# Altium schematic sheet STB_DUTConnector.SchDoc: STB  Sensor Board
size A4; Author: flmoll / gruprecht; DrawnBy: flmoll; Organization: PBL; Revision: A; SheetNumber: 8; SheetTotal: 8
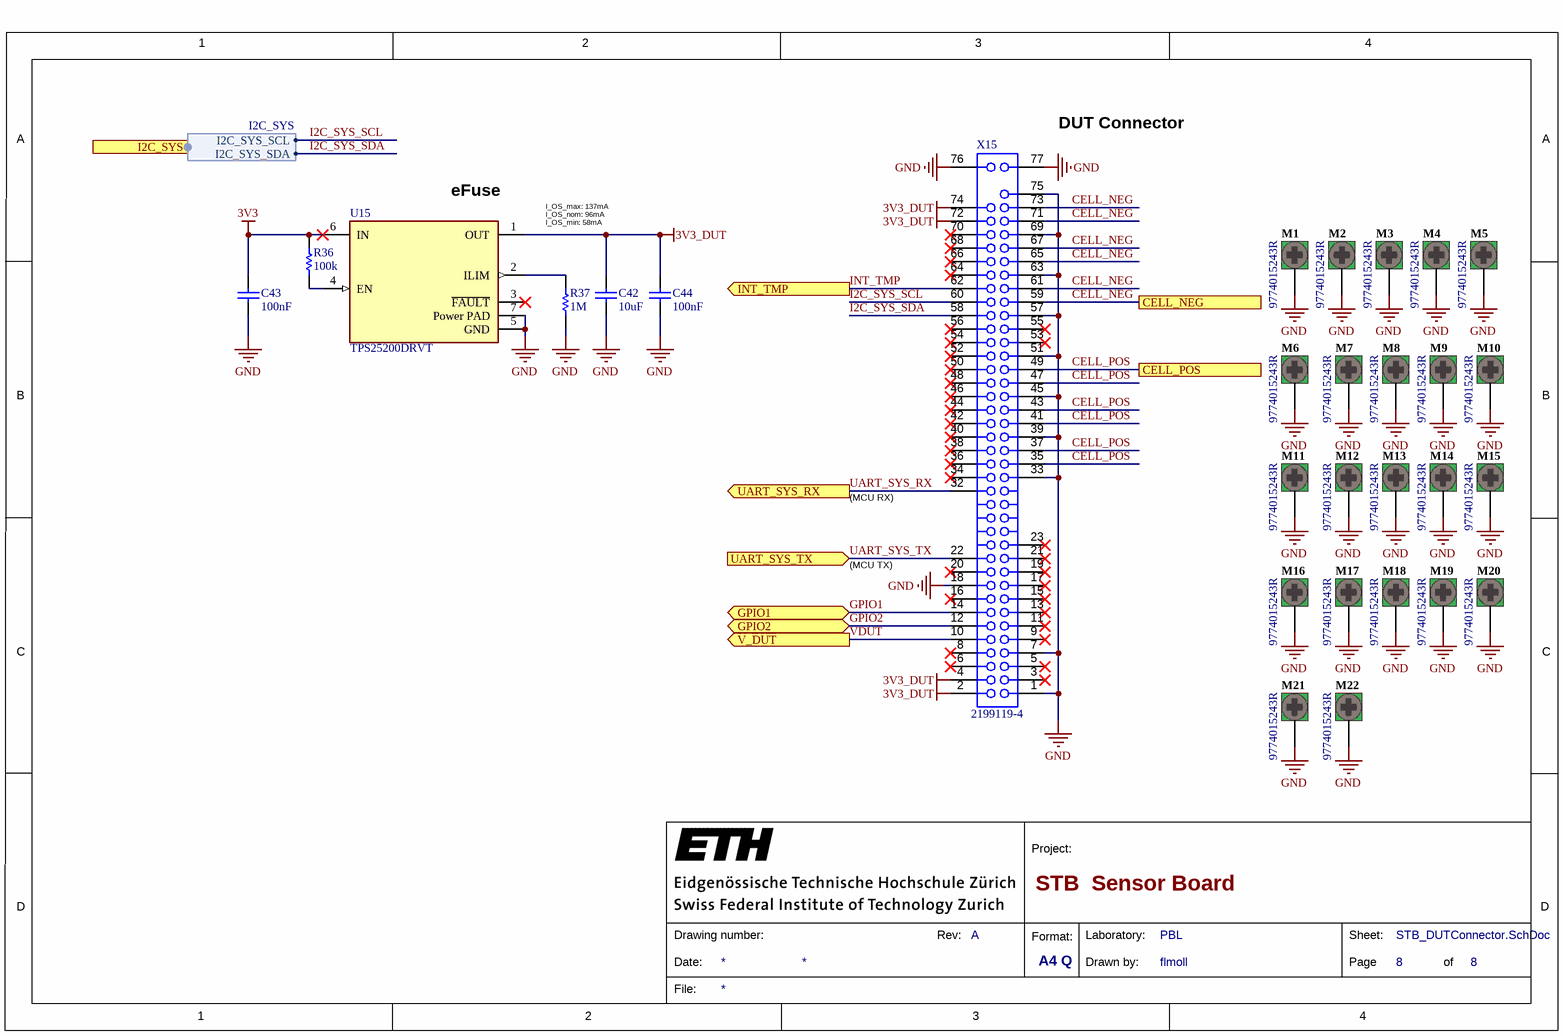
[diagram p0: STB_DUTConnector.SchDoc]

## Parts
C42  10uF  [CAPC0603(1608)100_L]
C43  100nF  [CAPC1050X55X23LL05T13]
C44  100nF  [CAPC1050X55X23LL05T13]
M1  9774015243R  [9774015243R]
M2  9774015243R  [9774015243R]
M3  9774015243R  [9774015243R]
M4  9774015243R  [9774015243R]
M5  9774015243R  [9774015243R]
M6  9774015243R  [9774015243R]
M7  9774015243R  [9774015243R]
M8  9774015243R  [9774015243R]
M9  9774015243R  [9774015243R]
M10  9774015243R  [9774015243R]
M11  9774015243R  [9774015243R]
M12  9774015243R  [9774015243R]
M13  9774015243R  [9774015243R]
M14  9774015243R  [9774015243R]
M15  9774015243R  [9774015243R]
M16  9774015243R  [9774015243R]
M17  9774015243R  [9774015243R]
M18  9774015243R  [9774015243R]
M19  9774015243R  [9774015243R]
M20  9774015243R  [9774015243R]
M21  9774015243R  [9774015243R]
M22  9774015243R  [9774015243R]
R36  100k  [RESC1005X40X25LL05T10]
R37  1M  [RESC1005X40X25LL05T10]
U15  TPS25200DRVT  [FP-DRV0006A-MFG]
X15  2199119-4  [2199119-4]

## Ports
CELL_NEG, CELL_POS, GPIO1 (bidir), GPIO2 (bidir), I2C_SYS (harness I2C_SYS), INT_TMP (out), UART_SYS_RX (out), UART_SYS_TX (in), V_DUT (out)

## Harnesses
I2C_SYS: I2C_SYS_SDA, I2C_SYS_SCL

## Nets
3V3: C43.2 R36.1 U15.6(IN)
3V3_DUT: C42.2 C44.2 U15.1(OUT) X15.2 X15.4 X15.72 X15.74
GND: C42.1 C43.1 C44.1 M1.1 M2.1 M3.1 M4.1 M5.1 M6.1 M7.1 M8.1 M9.1 M10.1 M11.1 M12.1 M13.1 M14.1 M15.1 M16.1 M17.1 M18.1 M19.1 M20.1 M21.1 M22.1 R37.1 U15.5(GND) U15.7(Power_PAD) X15.1 X15.7 X15.18 X15.33 X15.39 X15.45 X15.51 X15.57 X15.63 X15.69 X15.75 X15.76 X15.77
CELL_NEG: X15.59 X15.61 X15.65 X15.67 X15.71 X15.73 ; port CELL_NEG
CELL_POS: X15.35 X15.37 X15.41 X15.43 X15.47 X15.49 ; port CELL_POS
GPIO1: X15.14 ; port GPIO1
GPIO2: X15.12 ; port GPIO2
I2C_SYS_SCL: X15.60 ; port I2C_SYS.I2C_SYS_SCL
I2C_SYS_SDA: X15.58 ; port I2C_SYS.I2C_SYS_SDA
INT_TMP: X15.62 ; port INT_TMP
UART_SYS_RX: X15.32 ; port UART_SYS_RX
UART_SYS_TX: X15.22 ; port UART_SYS_TX
VDUT: X15.10 ; port V_DUT
NetR36_2: R36.2 U15.4(EN)
NetR37_2: R37.2 U15.2(ILIM)

Not connected (* = marked no-connect by the designer): U15 3(~{FAULT})*; X15 3* 5* 6* 8* 9* 11* 13* 15* 16* 17* 19* 20* 21* 23* 34* 36* 38* 40* 42* 44* 46* 48* 50* 52(51)* 53* 54(52)* 55* 56(53)* 64* 66* 68* 70*

## Notes on the sheet
- (near X15) DUT Connector
- (near U15) eFuse
- I_OS_max: 137mA
  I_OS_nom: 96mA
  I_OS_min: 58mA
- (MCU RX)
- (MCU TX)
- 1
- 2
- 3
- 4
- A
- B
- C
- Project:
- D
- Date:
- Drawing number:
- Rev:
- Format:
- A4 Q
- Drawn by:
- Laboratory:
- Page
- Sheet:
- of
- File:

## Library data of the parts
C42 = CMP-1035-02799-1: CAP 10uF 10V ±10% 0603 (1608 Metric) Thickness 1mm SMD; Manufacturer: Samsung; Manufacturer Part Number: CL10A106MP8NNNC; Tolerance: Â±10%; Case-Metric: 1608; Case-EIA: 0603; Dielectric: X5R; Max Thickness: 1 mm; Technology: SMT; Rated Voltage: 10 V; Value: 10uF; Supplier 1: Digi-Key; Supplier Part Number 1: 1276-1871-1-ND; RoHS: Yes; Category: Ceramic Capacitors; Stock 1: 643992; Pricing 1: 1=0.26000, 10=0.17600, 50=0.10580, 100=0.08930, 500=0.06112, 1000=0.05407 (USD); Mount: Surface Mount; Case/Package: 0603; Case Code (Imperial): 0603; Case Code (Metric): 1608; Contact Plating: Tin; Min Operating Temperature: -55°C; Max Operating Temperature: 85°C; Packaging: Tape and Reel; Capacitance: 10uF; Voltage Rating: 10V; Voltage Rating (DC): 10V; Package Quantity: 1; Length: 1.6mm; Width: 0.031inch; Height: 0.8mm; Thickness: 0.035inch; Depth: 0.8mm; Radiation Hardening: No; Lead Free: Lead Free; ComponentLink1URL: https://datasheet.ciiva.com/25793/cl10a106mp8nnnc-25793222.pdf?src-supplier=Digi-Key; ComponentLink1Description: https://datasheet.ciiva.com/25793/cl10a106mp8nnnc-25793222.pdf?src-supplier=Digi-Key; ComponentLink2URL: https://datasheet.ciiva.com/16200/cl10a106mp8nnnc-16200411.pdf?src-supplier=Future+Electronics; ComponentLink2Description: https://datasheet.ciiva.com/16200/cl10a106mp8nnnc-16200411.pdf?src-supplier=Future+Electronics; ComponentLink3URL: https://datasheet.ciiva.com/26946/getdatasheetpartid-357531-26946980.pdf?src-supplier=Verical; ComponentLink3Description: https://datasheet.ciiva.com/26946/getdatasheetpartid-357531-26946980.pdf?src-supplier=Verical
C43 C44 = CMP-2000-05439-1: Chip Capacitor, 100 nF, +/- 10%, 16 V, -55 to 125 degC, 0402 (1005 Metric), RoHS, Tape and Reel; Manufacturer: Samsung Electro-Mechanics; Manufacturer Part Number: CL05B104KO5NNNC; Dielectric: X7R; Rated Voltage: 16V; Dielectric Material: Ceramic; Multilayer: Yes; Case Size/Dimension: 0402; Tolerance (%): ±10%; Value: 100nF; Manufacturer URL: http://www.samsungsem.com/global/index.jsp; Datasheet URL: https://datasheet.ciiva.com/29198/458718-da-01-en-vs-kondensator-0402-29198423.pdf; Datasheet Version: Nov-10; Supplier 1: Digi-Key; Supplier Part Number 1: 1276-1001-6-ND; RoHS: Yes; Category: Ceramic Capacitors; Stock 1: 24854634; Pricing 1: 1=0.10000, 10=0.02400, 50=0.01300, 100=0.01050, 500=0.00752, 1000=0.00592, 2500=0.00538, 5000=0.00495 (USD); Mount: Surface Mount; Number of Pins: 2; Package Shape: Rectangular; Size Code: 0402; Terminal Finish: Nickel; Min Operating Temperature: -55°C; Max Operating Temperature: 125°C; JESD-609 Code: e3; Capacitor Type: Ceramic; Negative Tolerance: 10%; Packaging: Tape and Reel; Positive Tolerance: 10%; Rated DC Voltage (URdc): 16V; Temperature Characteristics Code: X7R; Termination: Wraparound; Package Style: SMTMeter; Length: 1mm; Width: 0.5mm; Height: 0.55mm; REACH SVHC: Yes; RoHS Compliant: Yes; ComponentLink1URL: https://datasheet.ciiva.com:443/pdfs/VipMasterIC/IC/SEMS/SEMS-S-A0008384515/SEMS-S-A0008872921-1.pdf?src-supplier=IHS+Markit; ComponentLink1Description: https://datasheet.ciiva.com:443/pdfs/VipMasterIC/IC/SEMS/SEMS-S-A0008384515/SEMS-S-A0008872921-1.pdf?src-supplier=IHS+Markit; ComponentLink2URL: https://datasheet.ciiva.com/26920/getdatasheetpartid-359683-26920169.pdf?src-supplier=Verical; ComponentLink2Description: https://datasheet.ciiva.com/26920/getdatasheetpartid-359683-26920169.pdf?src-supplier=Verical; ComponentLink3URL: https://datasheet.ciiva.com/29198/458718-da-01-en-vs-kondensator-0402-29198423.pdf?src-supplier=Conrad; ComponentLink3Description: https://datasheet.ciiva.com/29198/458718-da-01-en-vs-kondensator-0402-29198423.pdf?src-supplier=Conrad; ComponentLink4URL: https://datasheet.ciiva.com/26309/mlcc-catalogdownload2013-eng-26309003.pdf?src-supplier=Distrelec; ComponentLink4Description: https://datasheet.ciiva.com/26309/mlcc-catalogdownload2013-eng-26309003.pdf?src-supplier=Distrelec; ComponentLink5URL: https://datasheet.ciiva.com/16208/cl05b104kq5nnnc-16208343.pdf?src-supplier=Future+Electronics; ComponentLink5Description: https://datasheet.ciiva.com/16208/cl05b104kq5nnnc-16208343.pdf?src-supplier=Future+Electronics
M1-M22 = CMP-01222-1: RND STANDOFF M2X0.4 STEEL 1.5MM; Manufacturer: Wurth Electronics; Plating: Tin; Outside Diameter: 0.171inch; Threaded/Unthreaded: Threaded; Length: 0.114inch; REACH SVHC: Unknown; Material: Steel; Supplier 1: Digi-Key; Supplier Part Number 1: 732-7069-1-ND; Manufacturer Part Number: 9774015243R; RoHS: Yes; Category: Spacers, Standoffs; Stock 1: 6453; Pricing 1: 1=1.09000, 10=1.03000, 50=0.91800, 100=0.84000, 500=0.78400 (USD); ComponentLink1URL: http://www.mouser.com/ds/2/445/9774015243R-611439.pdf?src-supplier=Mouser; ComponentLink1Description: http://www.mouser.com/ds/2/445/9774015243R-611439.pdf?src-supplier=Mouser; ComponentLink2URL: http://www.farnell.com/datasheets/1960361.pdf?src-supplier=Farnell; ComponentLink2Description: http://www.farnell.com/datasheets/1960361.pdf?src-supplier=Farnell; ComponentLink3URL: https://media.digikey.com/pdf/Data%20Sheets/Wurth%20Electronics%20PDFs/WA-SMSx_Performance_Flyer.pdf?src-supplier=Digi-Key; ComponentLink3Description: https://media.digikey.com/pdf/Data%20Sheets/Wurth%20Electronics%20PDFs/WA-SMSx_Performance_Flyer.pdf?src-supplier=Digi-Key; ComponentLink4URL: http://www.farnell.com/datasheets/1960361.pdf?src-supplier=Element14; ComponentLink4Description: http://www.farnell.com/datasheets/1960361.pdf?src-supplier=Element14; ComponentLink5URL: https://katalog.we-online.de/em/datasheet/9774015243R.pdf?src-supplier=Digi-Key; ComponentLink5Description: https://katalog.we-online.de/em/datasheet/9774015243R.pdf?src-supplier=Digi-Key; ComponentLink6URL: http://www.farnell.com/datasheets/1960361.pdf?src-supplier=Newark; ComponentLink6Description: http://www.farnell.com/datasheets/1960361.pdf?src-supplier=Newark
R36 = CMP-2002-07343-1: Part Number: RC0402FR-07100KL; Manufacturer: Yageo / Phycomp; Tolerance: 1%; Rated Power Dissipation (P): 62.5mW; Rated Temperature: 70°C; Value: 100 kOhm; Temperature Coefficient: 100ppm/°C; Working Voltage: 50V; Additional Feature: LASER TRIMMABLE; Package Height: 0.35mm; Package Length: 1mm; Package Width: 0.5mm; Supplier 1: Digi-Key; Supplier Part Number 1: 311-100KLRDKR-ND; Manufacturer Part Number: RC0402FR-07100KL; RoHS: Yes; Category: Chip SMD Resistors; Stock 1: 43269933; Pricing 1: 1=0.10000, 10=0.01500, 100=0.00600, 1000=0.00267, 2500=0.00232, 5000=0.00192 (USD); Mount: Surface Mount; Number of Pins: 2; Size Code: 0402; Terminal Finish: Nickel; Package Shape: Rectangular; Min Operating Temperature: -55°C; Max Operating Temperature: 155°C; Resistor Type: FIXED RESISTOR; Technology: METAL GLAZE/THICK FILM; Termination: Wraparound; JESD-609 Code: e3; Construction: Chip; Package Style: SMTMeter; Packaging: Tape and Reel; REACH SVHC: Yes; RoHS Compliant: Yes; ComponentLink1URL: https://datasheet.ciiva.com:443/pdfs/VipMasterIC/IC/YAGO/YAGO-S-A0008145938/YAGO-S-A0008145938-1.pdf?src-supplier=IHS+Markit; ComponentLink1Description: https://datasheet.ciiva.com:443/pdfs/VipMasterIC/IC/YAGO/YAGO-S-A0008145938/YAGO-S-A0008145938-1.pdf?src-supplier=IHS+Markit
R37 = CMP-2002-07490-1: Manufacturer: Yageo / Phycomp; Part Number: RC0402FR-071ML; Tolerance: 1%; Rated Power Dissipation (P): 62.5mW; Rated Temperature: 70°C; Value: 1 MOhm; Temperature Coefficient: 100ppm/°C; Working Voltage: 50V; Additional Feature: LASER TRIMMABLE; Package Height: 0.35mm; Package Length: 1mm; Package Width: 0.5mm; Supplier 1: Digi-Key; Supplier Part Number 1: 311-1.00MLRDKR-ND; Manufacturer Part Number: RC0402FR-071ML; RoHS: Yes; Category: Chip SMD Resistors; Stock 1: 7275530; Pricing 1: 1=0.10000, 10=0.01500, 100=0.00600, 1000=0.00267, 2500=0.00232, 5000=0.00192 (USD); Mount: Surface Mount; Number of Pins: 2; Size Code: 0402; Terminal Finish: Nickel; Package Shape: Rectangular; Min Operating Temperature: -55°C; Max Operating Temperature: 155°C; JESD-609 Code: e3; Resistor Type: FIXED RESISTOR; Construction: Chip; Package Style: SMTMeter; Packaging: Tape and Reel; Technology: METAL GLAZE/THICK FILM; Termination: Wraparound; REACH SVHC: Yes; RoHS Compliant: Yes; ComponentLink1URL: https://datasheet.ciiva.com:443/pdfs/VipMasterIC/IC/YAGO/YAGO-S-A0008145938/YAGO-S-A0008145938-1.pdf?src-supplier=IHS+Markit; ComponentLink1Description: https://datasheet.ciiva.com:443/pdfs/VipMasterIC/IC/YAGO/YAGO-S-A0008145938/YAGO-S-A0008145938-1.pdf?src-supplier=IHS+Markit; ComponentLink2URL: https://datasheet.ciiva.com/11808/0900766b80c66297-11808125.pdf?src-supplier=RSComponents; ComponentLink2Description: https://datasheet.ciiva.com/11808/0900766b80c66297-11808125.pdf?src-supplier=RSComponents; ComponentLink3URL: https://datasheet.ciiva.com/46394/1018594-46394951.pdf?src-supplier=Element14; ComponentLink3Description: https://datasheet.ciiva.com/46394/1018594-46394951.pdf?src-supplier=Element14; ComponentLink4URL: https://datasheet.ciiva.com/7849/1018594-7849883.pdf?src-supplier=Element14; ComponentLink4Description: https://datasheet.ciiva.com/7849/1018594-7849883.pdf?src-supplier=Element14; ComponentLink5URL: https://datasheet.ciiva.com/7849/1018594-7849882.pdf?src-supplier=Element14; ComponentLink5Description: https://datasheet.ciiva.com/7849/1018594-7849882.pdf?src-supplier=Element14; ComponentLink6URL: https://datasheet.ciiva.com/16741/pyu-rc0402-51-rohs-l-6-r-16741081.pdf?src-supplier=Future+Electronics; ComponentLink6Description: https://datasheet.ciiva.com/16741/pyu-rc0402-51-rohs-l-6-r-16741081.pdf?src-supplier=Future+Electronics
U15 = CMP-04913-000017-1: IC PWR MGR EFUSE 6.5V 2.8A 6SON; Manufacturer: Texas Instruments; Min Supply Voltage: 2.5V; Number of Channels: 1; Current: 2.5A; Package Body Material: Plastic; Supply Voltage-Nom (Vsup): 5V; Adjustable Threshold: Yes; Analog IC - Other Type: POWER SUPPLY SUPPORT CIRCUIT; Max Operating Temperature: 125°C; Min Operating Temperature: -40°C; Voltage: 6.5V; Number of Outputs: 1; Lead Free: Lead Free; Contact Plating: Gold; Packaging: Cut Tape; Max Supply Voltage: 6.5V; REACH SVHC: No SVHC; Height: 0.75mm; Length: 2.1mm; RoHS Compliant: Yes; Features: Auto Retry; Mount: Surface Mount; Width: 2.1mm; Number of Pins: 6; Max Output Current: 2.5A; Supplier 1: Digi-Key; Supplier Part Number 1: 296-37760-6-ND; Manufacturer Part Number: TPS25200DRVT; RoHS: Yes; Category: Hot Swap Controllers; Stock 1: 21750; Pricing 1: 1=1.15000, 10=1.03200, 25=0.97960, 100=0.80450 (USD); Package Code: HVSON; Package Shape: Square; Terminal Finish: Nickel; JESD-609 Code: e4; Moisture Sensitivity Level: 2; Number of Functions: 1; Package Style: SMALL OUTLINE, HEAT SINK/SLUG, VERY THIN PROFILEMeter; Supply Voltage-Max (Vsup): 6.5V; Supply Voltage-Min (Vsup): 2.5V; Surface Mount: Yes; Terminal Form: No Lead; Terminal Position: DUAL; JESD-30 Code: S-PDSO-N6; Peak Reflow Temperature (Cel): 260°C; Height - Seated (Max): 0.8mm; Terminal Pitch: 0.65mm; Temperature Grade: AUTOMOTIVE; ComponentLink1URL: https://www.ti.com:443/lit/ds/symlink/tps25200.pdf?src-supplier=IHS+Markit; ComponentLink1Description: https://www.ti.com:443/lit/ds/symlink/tps25200.pdf?src-supplier=IHS+Markit; ComponentLink2URL: https://datasheet.ciiva.com/46433/1821153-46433335.pdf?src-supplier=Element14; ComponentLink2Description: https://datasheet.ciiva.com/46433/1821153-46433335.pdf?src-supplier=Element14
X15 = CMP-01221-1: 67 Position Female Connector M.2 (NGFF) Mini Card Gold 0.020" (0.50mm) Black; Manufacturer: TE Connectivity; Manufacturer Part Number: 2199230-4; PCB Mounting Orientation: Right Angle; Contact Current Rating: 500mA; Pitch: 0.5mm; Row Spacing: 7.55mm; Voltage Rating: 50V; Insulation Resistance: 500MR; Number of Positions: 67; Gender: Female; Termination: Solder; Max Operating Temperature: 80°C; REACH SVHC: Unknown; Width: 8.7mm; ELV: Compliant; Package Quantity: 1; Current Rating: 500mA; Packaging: Tape and Reel; Height: 3.2mm; Length: 0.862inch; Mount: Surface Mount; Insulation Material: Thermoplastic; Contact Plating: Gold,Matte; Housing Material: Thermoplastic; Min Operating Temperature: -40°C; Housing Color: Black; Number of Contacts: 67; Orientation: Right Angle; Contact Material: Copper Alloy; Color: Black; Number of Rows: 2; Supplier 1: Digi-Key; Supplier Part Number 1: A115904CT-ND; RoHS: Yes; Category: Card Edge Connectors; Stock 1: 14351; Pricing 1: 1=1.29000, 10=1.13700, 25=1.07000, 50=1.02560, 100=0.98100, 250=0.89180, 500=0.80262 (USD); RoHS Compliant: Yes; ComponentLink1URL: https://datasheet.ciiva.com/28797/1918022-28797830.pdf?src-supplier=Element14; ComponentLink1Description: https://datasheet.ciiva.com/28797/1918022-28797830.pdf?src-supplier=Element14; ComponentLink2URL: https://datasheet.ciiva.com/18495/eng-cd-2199230-b1-c-2199230-b1-18495978.pdf?src-supplier=Digi-Key; ComponentLink2Description: https://datasheet.ciiva.com/18495/eng-cd-2199230-b1-c-2199230-b1-18495978.pdf?src-supplier=Digi-Key; ComponentLink3URL: https://datasheet.ciiva.com/18495/eng-cd-2199230-b1-c-2199230-b1-18495979.pdf?src-supplier=Digi-Key; ComponentLink3Description: https://datasheet.ciiva.com/18495/eng-cd-2199230-b1-c-2199230-b1-18495979.pdf?src-supplier=Digi-Key; ComponentLink4URL: https://datasheet.ciiva.com/18495/eng-cd-2199230-b1-c-2199230-b1-18495980.pdf?src-supplier=Digi-Key; ComponentLink4Description: https://datasheet.ciiva.com/18495/eng-cd-2199230-b1-c-2199230-b1-18495980.pdf?src-supplier=Digi-Key; ComponentLink5URL: https://datasheet.ciiva.com/22714/1918022-22714780.pdf?src-supplier=Element14; ComponentLink5Description: https://datasheet.ciiva.com/22714/1918022-22714780.pdf?src-supplier=Element14; ComponentLink6URL: https://datasheet.ciiva.com/28797/1918022-28797822.pdf?src-supplier=Element14; ComponentLink6Description: https://datasheet.ciiva.com/28797/1918022-28797822.pdf?src-supplier=Element14